# Altium project Volant5.PrjPcb
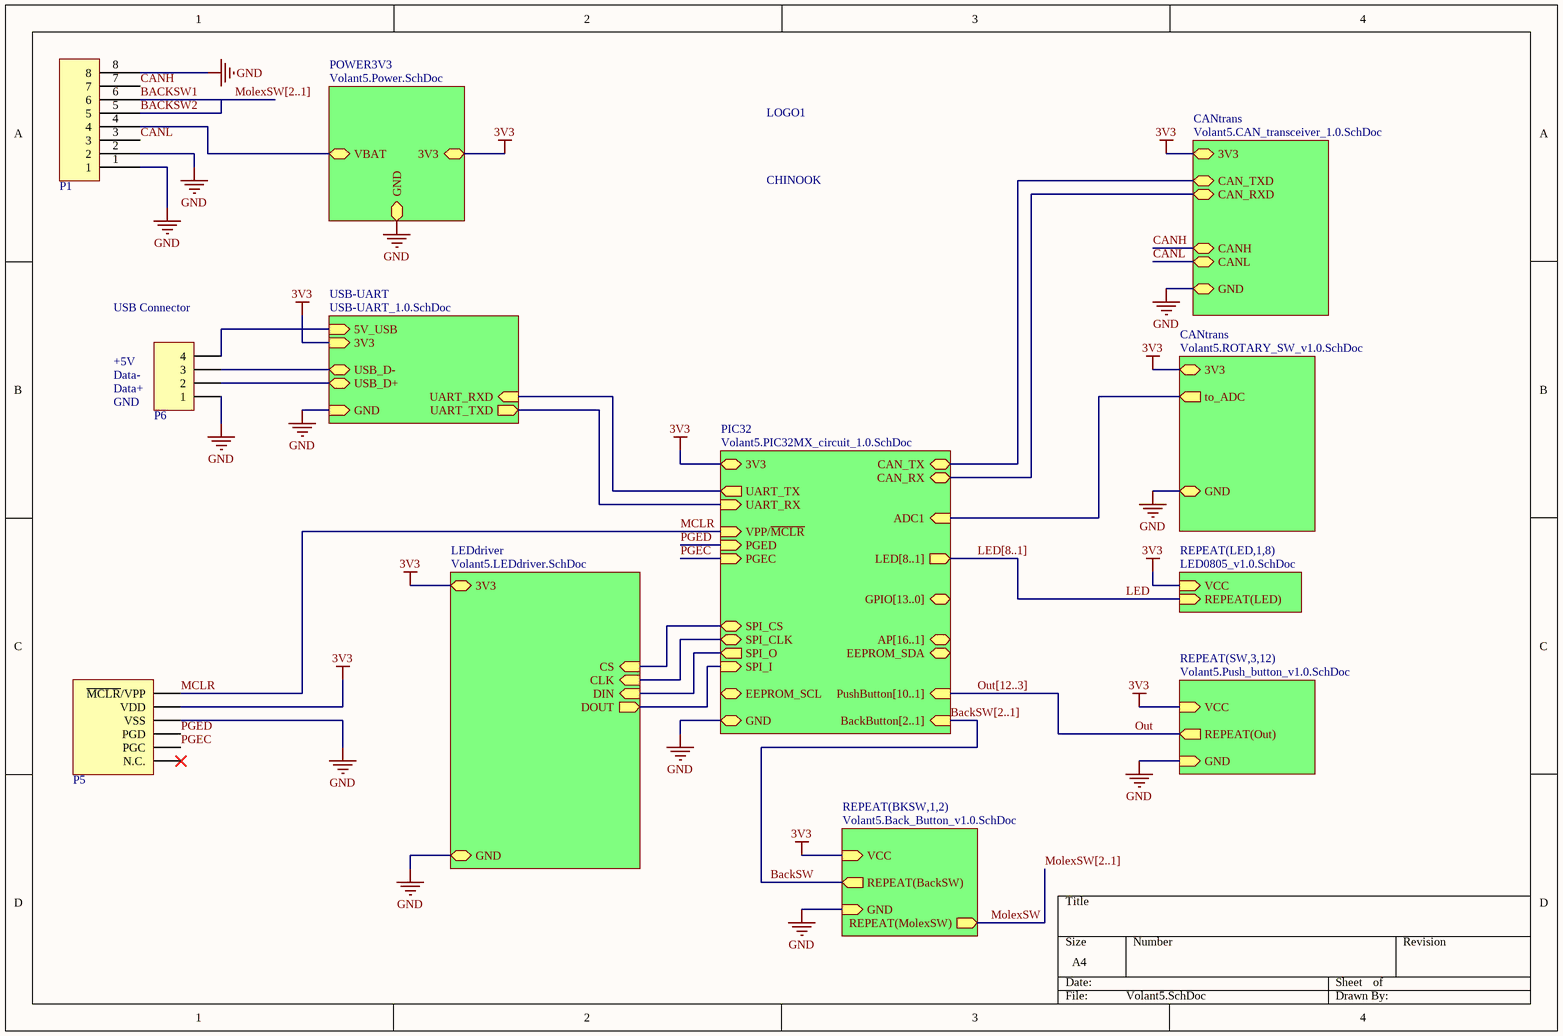
[diagram p0: Volant5.SchDoc]
10 sheets, 133 parts. Net scope: hierarchical (ports join the sheet entries above them; power ports are global).
Board file: Volant_v2.PcbDoc
Sheets:
  Volant5.SchDoc
    POWER3V3 = Volant5.Power.SchDoc
    PIC32 = Volant5.PIC32MX_circuit_1.0.SchDoc
    CANtrans = Volant5.CAN_transceiver_1.0.SchDoc
    SW3 = Volant5.Push_button_v1.0.SchDoc
    SW4 = Volant5.Push_button_v1.0.SchDoc
    SW5 = Volant5.Push_button_v1.0.SchDoc
    SW6 = Volant5.Push_button_v1.0.SchDoc
    SW7 = Volant5.Push_button_v1.0.SchDoc
    SW8 = Volant5.Push_button_v1.0.SchDoc
    SW9 = Volant5.Push_button_v1.0.SchDoc
    SW10 = Volant5.Push_button_v1.0.SchDoc
    SW11 = Volant5.Push_button_v1.0.SchDoc
    SW12 = Volant5.Push_button_v1.0.SchDoc
    LED1 = LED0805_v1.0.SchDoc
    LED2 = LED0805_v1.0.SchDoc
    LED3 = LED0805_v1.0.SchDoc
    LED4 = LED0805_v1.0.SchDoc
    LED5 = LED0805_v1.0.SchDoc
    LED6 = LED0805_v1.0.SchDoc
    LED7 = LED0805_v1.0.SchDoc
    LED8 = LED0805_v1.0.SchDoc
    LEDdriver = Volant5.LEDdriver.SchDoc
    USB-UART = USB-UART_1.0.SchDoc
    BKSW1 = Volant5.Back_Button_v1.0.SchDoc
    BKSW2 = Volant5.Back_Button_v1.0.SchDoc
    CANtrans = Volant5.ROTARY_SW_v1.0.SchDoc

## Sheet Volant5.SchDoc
size A4

### Parts
LOGO1  CHINOOK  [LOGO-CHINOOK]
P1  CON - MOLEX 8POS  [CON-MOLEX Mini Jr 8pin - RA]  (value not drawn)
P5  CON - HEADER PROG  [CON-PROG-PIC]  (value not drawn)
P6  CON - HEADER 1X4  [CON-HEADER-1X4]  (value not drawn)

### Sub-sheets
CANtrans = Volant5.CAN_transceiver_1.0.SchDoc: CAN_RXD (bidir), CAN_TXD (bidir), CANH (bidir), CANL (bidir), 3V3, GND
CANtrans = Volant5.ROTARY_SW_v1.0.SchDoc: to_ADC (out), GND, 3V3
LEDdriver = Volant5.LEDdriver.SchDoc: 3V3, GND, CLK (in), DIN (in), DOUT (out), CS (in)
PIC32 = Volant5.PIC32MX_circuit_1.0.SchDoc: 3V3, GND, CAN_RX (bidir), CAN_TX (bidir), UART_TX (out), UART_RX (in), AP[16..1] (bidir), GPIO[13..0] (bidir), EEPROM_SCL (bidir), EEPROM_SDA (bidir), PGED (in), PGEC (in), LED[8..1] (out), VPP/~{MCLR} (in), SPI_O (out), SPI_I (in), SPI_CLK, PushButton[10..1] (in), SPI_CS, BackButton[2..1] (in), ADC1 (in)
POWER3V3 = Volant5.Power.SchDoc: 3V3, GND, VBAT
REPEAT(BKSW,1,2) = Volant5.Back_Button_v1.0.SchDoc: REPEAT(BackSW) (out), VCC (in), GND (in), REPEAT(MolexSW) (out)
REPEAT(LED,1,8) = LED0805_v1.0.SchDoc: VCC (in), REPEAT(LED) (in)
REPEAT(SW,3,12) = Volant5.Push_button_v1.0.SchDoc: REPEAT(Out) (out), VCC (in), GND (in)
USB-UART = USB-UART_1.0.SchDoc: 3V3 (in), GND (in), UART_RXD (in), UART_TXD (out), 5V_USB (in), USB_D- (bidir), USB_D+ (bidir)

### Nets
3V3: P5.2(VDD) ; sheet POWER3V3/3V3, sheet PIC32/3V3, sheet CANtrans/3V3, sheet REPEAT(SW,3,12)/VCC, sheet REPEAT(LED,1,8)/VCC, sheet LEDdriver/3V3, sheet USB-UART/3V3, sheet REPEAT(BKSW,1,2)/VCC, sheet CANtrans/3V3
5V_USB: P6.4 ; sheet USB-UART/5V_USB
GND: P1.1 P1.2 P1.8 P5.3(VSS) P6.1 ; sheet POWER3V3/GND, sheet PIC32/GND, sheet CANtrans/GND, sheet REPEAT(SW,3,12)/GND, sheet LEDdriver/GND, sheet USB-UART/GND, sheet REPEAT(BKSW,1,2)/GND, sheet CANtrans/GND
VBAT: P1.4 ; sheet POWER3V3/VBAT
AP3: sheet PIC32/ADC1, sheet CANtrans/to_ADC
BackSW: sheet REPEAT(BKSW,1,2)/REPEAT(BackSW)
BACKSW1: P1.6  [also labelled MolexSW1]
BACKSW2: P1.5  [also labelled MolexSW2]
CAN_RX: sheet PIC32/CAN_RX, sheet CANtrans/CAN_RXD
CAN_TX: sheet PIC32/CAN_TX, sheet CANtrans/CAN_TXD
CANH: P1.7 ; sheet CANtrans/CANH
CANL: P1.3 ; sheet CANtrans/CANL
CLK: sheet PIC32/SPI_CLK, sheet LEDdriver/CLK
CS: sheet PIC32/SPI_CS, sheet LEDdriver/CS
DIN: sheet PIC32/SPI_O, sheet LEDdriver/DIN
DOUT: sheet PIC32/SPI_I, sheet LEDdriver/DOUT
LED: sheet REPEAT(LED,1,8)/REPEAT(LED)
MCLR: P5.1(~{MCLR}/VPP) ; sheet PIC32/VPP/~{MCLR}
MolexSW: sheet REPEAT(BKSW,1,2)/REPEAT(MolexSW)
Out: sheet REPEAT(SW,3,12)/REPEAT(Out)
PGEC: P5.5(PGC) ; sheet PIC32/PGEC
PGED: P5.4(PGD) ; sheet PIC32/PGED
UART_RXD: sheet PIC32/UART_TX, sheet USB-UART/UART_RXD
UART_TXD: sheet PIC32/UART_RX, sheet USB-UART/UART_TXD
USB_D+: P6.2 ; sheet USB-UART/USB_D+
USB_D-: P6.3 ; sheet USB-UART/USB_D-

Not connected (* = marked no-connect by the designer): P5 6(N.C.)*

### Buses and harness runs
bus BackSW[2..1] = sheet PIC32/BackButton[2..1]
bus LED[8..1] = sheet PIC32/LED[8..1]
bus MolexSW[2..1]
bus Out[12..3] = sheet PIC32/PushButton[10..1]

### Notes on the sheet
- (near P6) USB Connector
- +5V
- (near P6) Data-
- (near P6) Data+
- GND

### Library data of the parts
LOGO1 = LOGO - FOOTPRINT
P1 = CON - MOLEX 8POS: Mini-Fit Jr 8pin; (FLIED A): *; (FLIED B): *; (FLIED C): *; Manufacturer: MOLEX; Supplier 1: Digi-Key; Supplier Part Number 1: A30617-ND
P5 = CON - PROG HEADER 6: MICROCHIP CONNECTOR; (FLIED A): *; (FLIED B): *; (FLIED C): *; Manufacturer: *; Supplier 1: Digi-Key; Supplier Part Number 1: 609-3263-ND
P6 = CON - HEADER 1X4: 100mil header 1 row 4pins; Manufacturer: *; (FIELD A): *; (FIELD B): *; (FIELD C): *; Supplier 1: Digi-Key; Supplier Part Number 1: S1011EC-04-ND

## Sheet Volant5.Power.SchDoc
size A4
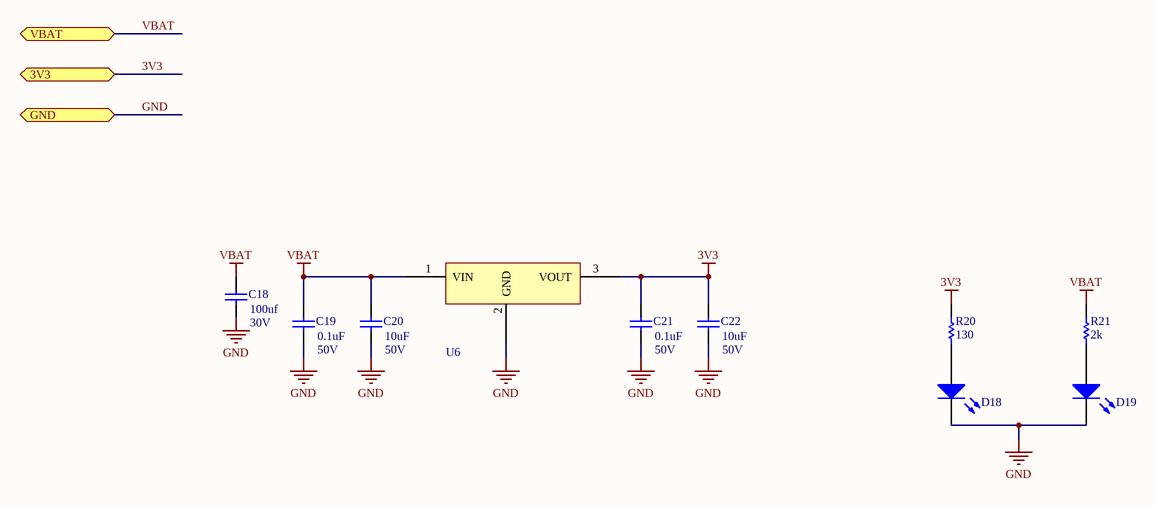
[diagram p1: Volant5.Power.SchDoc]

### Parts
C18  value 100uf  VOLTAGE: 30V  [CS-0603]  (hidden comment: CS - CAPACITOR)
C19  value 0.1uF  VOLTAGE: 50V  [CS-0603]  (hidden comment: CS - CAPACITOR)
C20  value 10uF  VOLTAGE: 50V  [CS-0603]  (hidden comment: CS - CAPACITOR)
C21  value 0.1uF  VOLTAGE: 50V  [CS-0603]  (hidden comment: CS - CAPACITOR)
C22  value 10uF  VOLTAGE: 50V  [CS-0603]  (hidden comment: CS - CAPACITOR)
D18  LED - NORMAL LED  [LED-0805 YELLOW]  (value not drawn)
D19  LED - NORMAL LED  [LED-0805 YELLOW]  (value not drawn)
R20  value 130  [RS-0603]  (hidden comment: RS - RESISTOR)
R21  value 2k  [RS-0603]  (hidden comment: RS - RESISTOR)
U6  OKI-78SR  [IC-OKI78SR-RA]  (value not drawn)

### Ports
3V3, GND, VBAT

### Nets
3V3: C21.2 C22.2 R20.2 U6.3(VOUT) ; port 3V3
GND: C18.1 C19.1 C20.1 C21.1 C22.1 D18.K D19.K U6.2(GND) ; port GND
VBAT: C18.2 C19.2 C20.2 R21.2 U6.1(VIN) ; port VBAT
NetD18_A: D18.A R20.1
NetD19_A: D19.A R21.1

### Library data of the parts
C18-C22 = CS - CAPACITOR: TOLERANCE: 10%; Supplier 1: *; (FIELD A): *; (FLIED C): *; (FIELD B): *; Manufacturer: *
  C18: Supplier Part Number 1: 493-1355-ND
  C19 C21: Supplier Part Number 1: 399-5089-1-ND
  C20 C22: Supplier Part Number 1: 587-3238-1-ND
R20 R21 = RS - RESISTOR: TOLERANCE: RES TOL; POWER: RES POWER; Supplier 1: *; (FIELD A): *; (FLIED C): *; (FIELD B): *; Manufacturer: *
  R20: Supplier Part Number 1: RHM150CFCT-ND
  R21: Supplier Part Number 1: ERJ-3EKF2001V
U6 = IC - OKI-78SR: Supplier 1: Digi-Key; Supplier Part Number 1: 811-2195-5-ND; (FIELD A): *; (FIELD B): *; (FIELD C): *; Manufacturer: *
D18 D19 = LED - NORMAL LED: FORWARS VOLTAGE: *; CURRENT: *; COLOR: *; Supplier Part Number 1: *; Supplier 1: *; (FIELD B): *; (FIELD A): *; (FIELD C): *; Manufacturer: *

## Sheet Volant5.PIC32MX_circuit_1.0.SchDoc
size A4
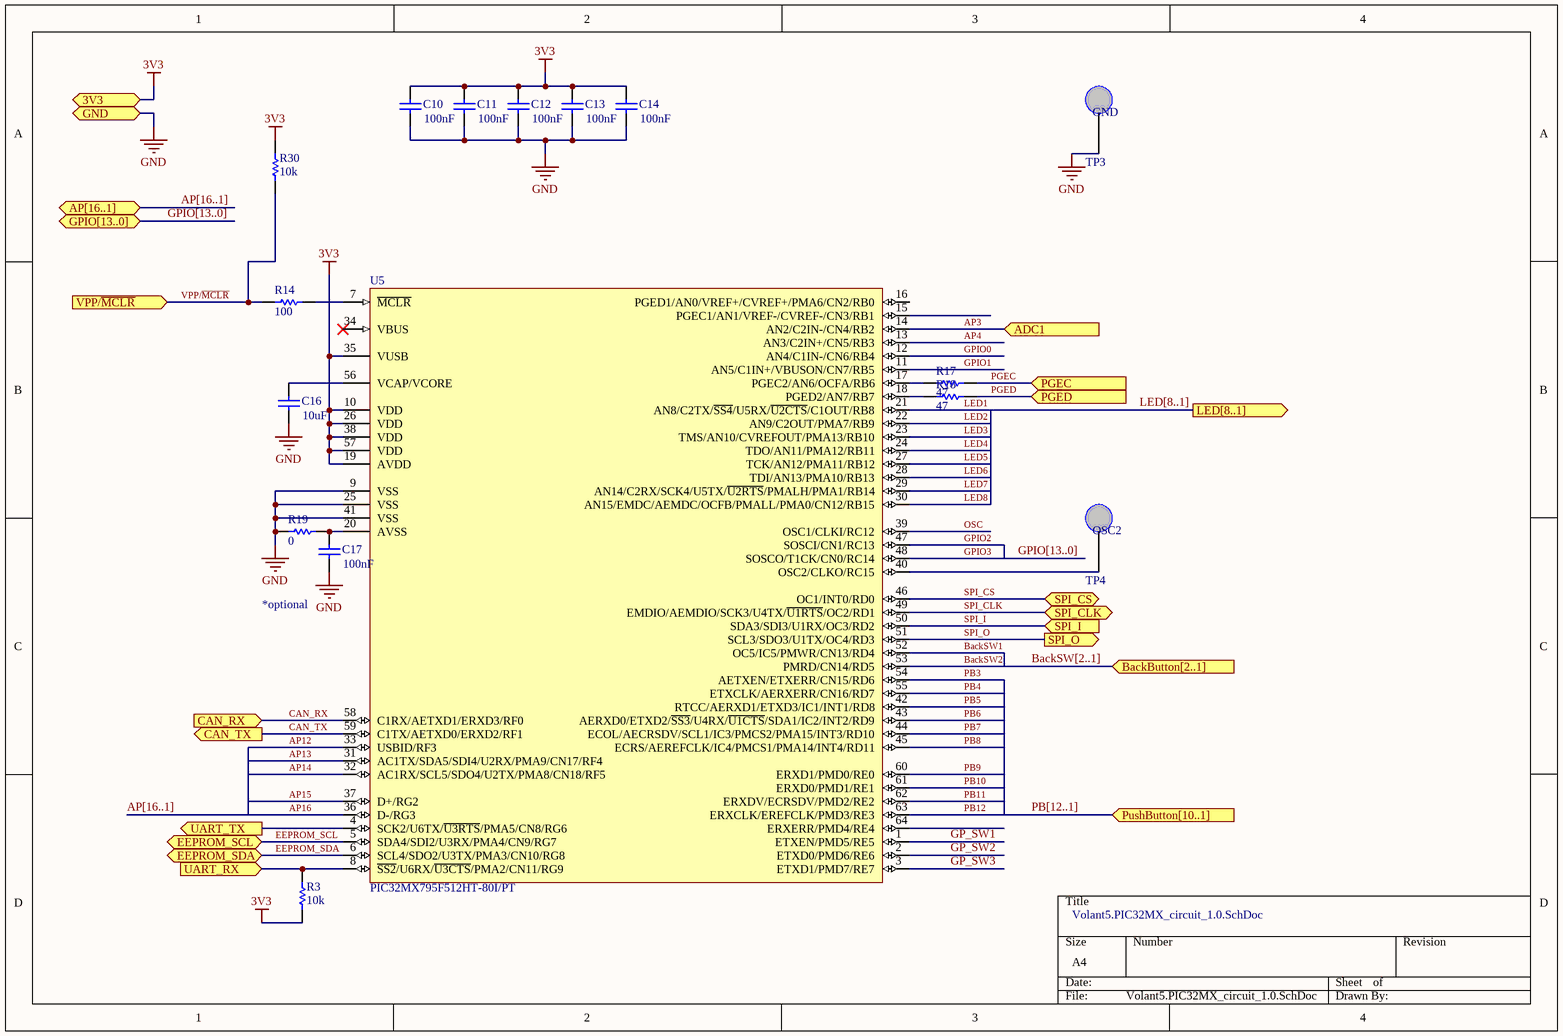
[diagram p2: Volant5.PIC32MX_circuit_1.0.SchDoc]

### Parts
C10  value 100nF  [CS-0603]  (hidden comment: CS - CAPACITOR)
C11  value 100nF  [CS-0603]  (hidden comment: CS - CAPACITOR)
C12  value 100nF  [CS-0603]  (hidden comment: CS - CAPACITOR)
C13  value 100nF  [CS-0603]  (hidden comment: CS - CAPACITOR)
C14  value 100nF  [CS-0603]  (hidden comment: CS - CAPACITOR)
C16  value 10uF  [CS-0603]  (hidden comment: CS - CAPACITOR)
C17  value 100nF  [CS-0603]  (hidden comment: CS - CAPACITOR)
R3  value 10k  [RS-0402]  (hidden comment: RS - RESISTOR)
R14  value 100  [RS-0603]  (hidden comment: RS - RESISTOR)
R17  value 47  [RS-0603]  (hidden comment: RS - RESISTOR)
R18  value 47  [RS-0603]  (hidden comment: RS - RESISTOR)
R19  value 0  [RS-0603]  (hidden comment: RS - RESISTOR)
R30  value 10k  [RS-0603]  (hidden comment: RS - RESISTOR)
TP3  GND  [TP - VERTICAL]
TP4  OSC2  [TP - VERTICAL]
U5  PIC32MX795F512HT-80I/PT  [IC-TQFP-64]

### Ports
3V3, ADC1 (in), AP[16..1] (bidir), BackButton[2..1] (in), CAN_RX (in), CAN_TX (out), EEPROM_SCL (bidir), EEPROM_SDA (bidir), GND, GPIO[13..0] (bidir), LED[8..1] (out), PGEC (in), PGED (in), PushButton[10..1] (in), SPI_CLK, SPI_CS, SPI_I (in), SPI_O (out), UART_RX (in), UART_TX (out), VPP/~{MCLR} (in)

### Nets
3V3: C10.2 C11.2 C12.2 C13.2 C14.2 R3.1 R30.2 U5.10(VDD) U5.19(AVDD) U5.26(VDD) U5.35(VUSB) U5.38(VDD) U5.57(VDD) ; port 3V3
GND: C10.1 C11.1 C12.1 C13.1 C14.1 C16.1 C17.1 R19.2 TP3.1 U5.9(VSS) U5.25(VSS) U5.41(VSS) ; port GND
AP3: U5.14(AN2/C2IN-/CN4/RB2) ; port ADC1
AP4: U5.13(AN3/C2IN+/CN5/RB3)
AP12: U5.33(USBID/RF3)
AP13: U5.31(AC1TX/SDA5/SDI4/U2RX/PMA9/CN17/RF4)
AP14: U5.32(AC1RX/SCL5/SDO4/U2TX/PMA8/CN18/RF5)
AP15: U5.37(D+/RG2)
AP16: U5.36(D-/RG3)
BACKSW1: U5.52(OC5/IC5/PMWR/CN13/RD4)
BACKSW2: U5.53(PMRD/CN14/RD5)
CAN_RX: U5.58(C1RX/AETXD1/ERXD3/RF0) ; port CAN_RX
CAN_TX: U5.59(C1TX/AETXD0/ERXD2/RF1) ; port CAN_TX
EEPROM_SCL: U5.5(SDA4/SDI2/U3RX/PMA4/CN9/RG7) ; port EEPROM_SCL
EEPROM_SDA: U5.6(SCL4/SDO2/U3TX/PMA3/CN10/RG8) ; port EEPROM_SDA
GP_SW1: U5.1(ETXEN/PMD5/RE5)
GP_SW2: U5.2(ETXD0/PMD6/RE6)
GP_SW3: U5.3(ETXD1/PMD7/RE7)
GPIO0: U5.12(AN4/C1IN-/CN6/RB4)
GPIO1: U5.11(AN5/C1IN+/VBUSON/CN7/RB5)
GPIO2: U5.47(SOSCI/CN1/RC13)
GPIO3: U5.48(SOSCO/T1CK/CN0/RC14)
LED1: U5.21(AN8/C2TX/~{SS4}/U5RX/~{U2CTS}/C1OUT/RB8)
LED2: U5.22(AN9/C2OUT/PMA7/RB9)
LED3: U5.23(TMS/AN10/CVREFOUT/PMA13/RB10)
LED4: U5.24(TDO/AN11/PMA12/RB11)
LED5: U5.27(TCK/AN12/PMA11/RB12)
LED6: U5.28(TDI/AN13/PMA10/RB13)
LED7: U5.29(AN14/C2RX/SCK4/U5TX/~{U2RTS}/PMALH/PMA1/RB14)
LED8: U5.30(AN15/EMDC/AEMDC/OCFB/PMALL/PMA0/CN12/RB15)
OSC: U5.39(OSC1/CLKI/RC12)
PB3: U5.54(AETXEN/ETXERR/CN15/RD6)  [project net Out3]
PB4: U5.55(ETXCLK/AERXERR/CN16/RD7)  [project net Out4]
PB5: U5.42(RTCC/AERXD1/ETXD3/IC1/INT1/RD8)  [project net Out5]
PB6: U5.43(AERXD0/ETXD2/~{SS3}/U4RX/~{U1CTS}/SDA1/IC2/INT2/RD9)  [project net Out6]
PB7: U5.44(ECOL/AECRSDV/SCL1/IC3/PMCS2/PMA15/INT3/RD10)  [project net Out7]
PB8: U5.45(ECRS/AEREFCLK/IC4/PMCS1/PMA14/INT4/RD11)  [project net Out8]
PB9: U5.60(ERXD1/PMD0/RE0)  [project net Out9]
PB10: U5.61(ERXD0/PMD1/RE1)  [project net Out10]
PB11: U5.62(ERXDV/ECRSDV/PMD2/RE2)  [project net Out11]
PB12: U5.63(ERXCLK/EREFCLK/PMD3/RE3)  [project net Out12]
PGEC: R17.1 ; port PGEC
PGED: R18.1 ; port PGED
SPI_CLK: U5.49(EMDIO/AEMDIO/SCK3/U4TX/~{U1RTS}/OC2/RD1) ; port SPI_CLK  [project net CLK]
SPI_CS: U5.46(OC1/INT0/RD0) ; port SPI_CS  [project net CS]
SPI_I: U5.50(SDA3/SDI3/U1RX/OC3/RD2) ; port SPI_I  [project net DOUT]
SPI_O: U5.51(SCL3/SDO3/U1TX/OC4/RD3) ; port SPI_O  [project net DIN]
UART_RXD: U5.4(SCK2/U6TX/~{U3RTS}/PMA5/CN8/RG6) ; port UART_TX
UART_TXD: R3.2 U5.8(~{SS2}/U6RX/~{U3CTS}/PMA2/CN11/RG9) ; port UART_RX
VPP/~{MCLR}: R14.2 R30.1 ; port VPP/~{MCLR}  [project net MCLR]
NetC16_2: C16.2 U5.56(VCAP/VCORE)
NetC17_2: C17.2 R19.1 U5.20(AVSS)
NetR14_1: R14.1 U5.7(~{MCLR})
NetR17_2: R17.2 U5.17(PGEC2/AN6/OCFA/RB6)
NetR18_2: R18.2 U5.18(PGED2/AN7/RB7)
NetTP4_1: TP4.1 U5.40(OSC2/CLKO/RC15)

Not connected (* = marked no-connect by the designer): U5 15(PGEC1/AN1/VREF-/CVREF-/CN3/RB1) 16(PGED1/AN0/VREF+/CVREF+/PMA6/CN2/RB0) 34(VBUS)* 64(ERXERR/PMD4/RE4)

### Buses and harness runs
bus AP[16..1]
bus AP[16..1] = port AP[16..1]
bus BackSW[2..1] = port BackButton[2..1]
bus GPIO[13..0]
bus GPIO[13..0] = port GPIO[13..0]
bus LED[8..1] = port LED[8..1]
bus PB[12..1] = port PushButton[10..1]

### Notes on the sheet
- *optional

### Library data of the parts
C10-C14 C16 C17 = CS - CAPACITOR: TOLERANCE: 10%; Supplier 1: *; (FIELD A): *; (FLIED C): *; (FIELD B): *; Manufacturer: *
  C10-C14 C17: Supplier Part Number 1: 490-1532-1-ND
  C16: Supplier Part Number 1: 587-3238-1-ND
R3 R14 R17-R19 R30 = RS - RESISTOR: TOLERANCE: RES TOL; POWER: RES POWER; Supplier 1: *; (FIELD A): *; (FLIED C): *; (FIELD B): *; Manufacturer: *
  R3 R30: Supplier Part Number 1: *
  R14: Supplier Part Number 1: P100GCT-ND
  R17 R18: Supplier Part Number 1: 1276-4539-1-ND
  R19: Supplier Part Number 1: P0.0GCT-ND
TP3 TP4 = TP - Test point vertical: (FIELD A): *; (FIELD B): *; (FIELD C): *; Manufacturer: *; Supplier 1: Newark; Supplier Part Number 1: 62W5140
U5 = IC - PIC32MX795F512HT-80I/PT: Manufacturer: Microchip; (FLIED A): *; (FLIED B): *; (FLIED C): *; Supplier 1: Digi-Key; Supplier Part Number 1: PIC32MX795F512H-80I/PT-ND

## Sheet Volant5.CAN_transceiver_1.0.SchDoc
size A
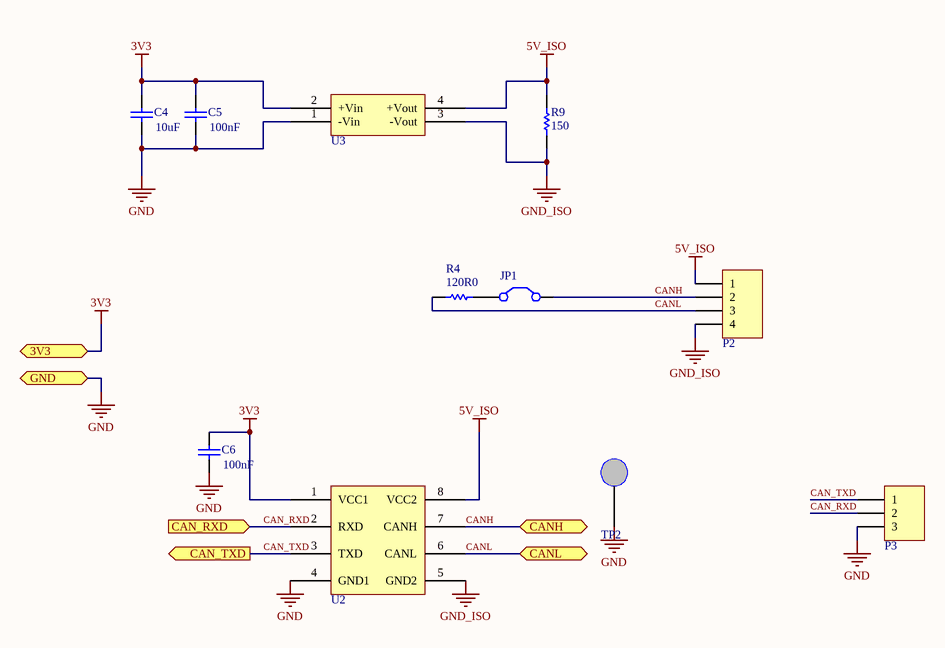
[diagram p3: Volant5.CAN_transceiver_1.0.SchDoc]

### Parts
C4  value 10uF  [CS-0603]  (hidden comment: CS - CAPACITOR)
C5  value 100nF  [CS-0603]  (hidden comment: CS - CAPACITOR)
C6  value 100nF  [CS-0603]  (hidden comment: CS - CAPACITOR)
JP1  JMP - Jumper  [HEADER-2-JMP]  (value not drawn)
P2  CON - HEADER 1X4  [CON-HEADER-1X4]  (value not drawn)
P3  CON - HEADER 1X3  [CON-HEADER-1X3]  (value not drawn)
R4  value 120R0  [RS-0603]  (hidden comment: RS - RESISTOR)
R9  value 150  [RS-0603]  (hidden comment: RS - RESISTOR)
TP2  5003K  [TP - VERTICAL]  (value not drawn)
U2  IC - ISO1050  [IC-SOP-8]  (value not drawn)
U3  IC - CME0305S3C  [IC-SIP-4]  (value not drawn)

### Ports
3V3, CAN_RXD (in), CAN_TXD (out), CANH (bidir), CANL (bidir), GND

### Nets
3V3: C4.2 C5.2 C6.2 U2.1(VCC1) U3.2(+Vin) ; port 3V3
5V_ISO: P2.1 R9.2 U2.8(VCC2) U3.4(+Vout)
GND: C4.1 C5.1 C6.1 P3.3 TP2.1 U2.4(GND1) U3.1(-Vin) ; port GND
GND_ISO: P2.4 R9.1 U2.5(GND2) U3.3(-Vout)
CAN_RXD: P3.2 U2.2(RXD) ; port CAN_RXD  [project net CAN_RX]
CAN_TXD: P3.1 U2.3(TXD) ; port CAN_TXD  [project net CAN_TX]
CANH: JP1.2(C2) P2.2 U2.7(CANH) ; port CANH
CANL: P2.3 R4.2 U2.6(CANL) ; port CANL
NetJP1_1: JP1.1(C1) R4.1

### Library data of the parts
C4-C6 = CS - CAPACITOR: TOLERANCE: 10%; Supplier 1: *; (FIELD A): *; (FLIED C): *; (FIELD B): *; Manufacturer: *
  C4: Supplier Part Number 1: 587-3238-1-ND
  C5 C6: Supplier Part Number 1: 490-1532-1-ND
JP1 = JMP - Jumper: Jumper; Supplier Part Number 1: *; Supplier 1: *; Manufacturer: *; (FIELD A): *; (FIELD B): *; (FIELD C): *
P2 = CON - HEADER 1X4: 100mil header 1 row 4pins; Manufacturer: *; (FIELD A): *; (FIELD B): *; (FIELD C): *; Supplier 1: Digi-Key; Supplier Part Number 1: S1011EC-04-ND
P3 = CON - HEADER 1X3: 100mil header 1 row 3pins; Manufacturer: *; (FIELD A): *; (FIELD B): *; (FIELD C): *; Supplier 1: Digi-Key; Supplier Part Number 1: S1212EC-03-ND
R4 R9 = RS - RESISTOR: TOLERANCE: RES TOL; POWER: RES POWER; Supplier 1: *; (FIELD A): *; (FLIED C): *; (FIELD B): *; Manufacturer: *
  R4: Supplier Part Number 1: *
  R9: Supplier Part Number 1: RHM150CFCT-ND
TP2 = TP - Test point vertical: (FIELD A): *; (FIELD B): *; (FIELD C): *; Manufacturer: *; Supplier 1: Newark; Supplier Part Number 1: 62W5140
U2 = IC - ISO1050: Isolated CAN transceiver; Manufacturer: Texas Instrument; (FIELD A): *; (FIELD B): *; (FIELD C): *; Supplier 1: Digi-Key; Supplier Part Number 1: 296-24818-1-ND
U3 = IC - CME0305S3C: Supplier 1: Digi-Key; Supplier Part Number 1: 811-2890-5-ND; Manufacturer: *; (FIELD A): *; (FIELD B): *; (FIELD C): *

## Sheet Volant5.Push_button_v1.0.SchDoc
size A
Used 10 times, as channels SW3, SW4, SW5, SW6, SW7, SW8, SW9, SW10, SW11, SW12. Parts and nets are listed once, with the designators drawn on the sheet.
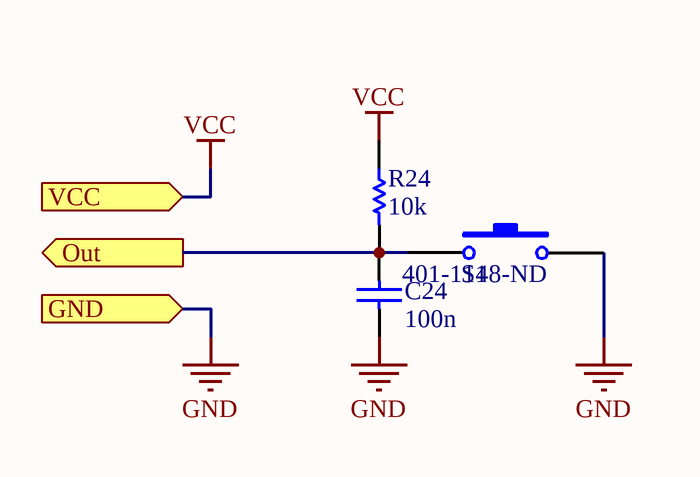
[diagram p4: Volant5.Push_button_v1.0.SchDoc]

### Parts
C24  value 100n  [CS-0603]  (hidden comment: CS - CAPACITOR)
R24  value 10k  [RS-0603]  (hidden comment: RS - RESISTOR)
S1  Cap black: 401-1148-ND  [SW-ESE20C443]  (hidden comment: SW - Tactile Switch)

### Ports
GND (in), Out (out), VCC (in)

### Nets
GND: C24.1 S1.2 ; port GND
VCC: R24.1 ; port VCC
Out: C24.2 R24.2 S1.1 ; port Out

### Channels
SW3: designators end in .1; ports GND=GND Out=Out3 VCC=3V3
SW4: designators end in .2; ports GND=GND Out=Out4 VCC=3V3
SW5: designators end in .3; ports GND=GND Out=Out5 VCC=3V3
SW6: designators end in .4; ports GND=GND Out=Out6 VCC=3V3
SW7: designators end in .5; ports GND=GND Out=Out7 VCC=3V3
SW8: designators end in .6; ports GND=GND Out=Out8 VCC=3V3
SW9: designators end in .7; ports GND=GND Out=Out9 VCC=3V3
SW10: designators end in .8; ports GND=GND Out=Out10 VCC=3V3
SW11: designators end in .9; ports GND=GND Out=Out11 VCC=3V3
SW12: designators end in .10; ports GND=GND Out=Out12 VCC=3V3

### Library data of the parts
C24 = CS - CAPACITOR: VOLTAGE: 16V; TOLERANCE: 10%; Supplier 1: *; Supplier Part Number 1: 490-1532-1-ND; (FIELD A): *; (FLIED C): *; (FIELD B): *; Manufacturer: *
R24 = RS - RESISTOR: POWER: RES POWER; TOLERANCE: RES TOL; Supplier Part Number 1: RHM10.0KCFCT-ND; Supplier 1: *; (FIELD A): *; (FLIED C): *; (FIELD B): *; Manufacturer: *
S1 = SW - Tactile Switch: Supplier 1: Digi-Key; Supplier Part Number 1: 450-1658-ND; (FLIED B): *; (FLIED C): *; Manufacturer: *; Supplier 2: Digi-Key; Supplier Part Number 2: 450-1758-2-ND; Supplier Part Number 3: P12347S-ND

## Sheet LED0805_v1.0.SchDoc
size A
Used 8 times, as channels LED1, LED2, LED3, LED4, LED5, LED6, LED7, LED8. Parts and nets are listed once, with the designators drawn on the sheet.
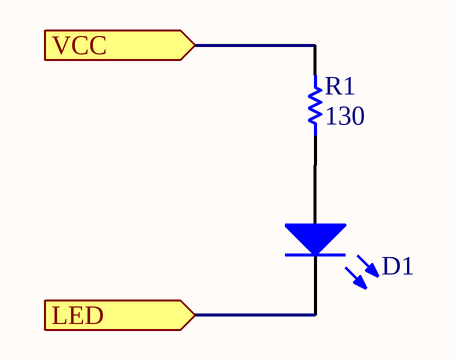
[diagram p5: LED0805_v1.0.SchDoc]

### Parts
D1  LED - NORMAL LED  [LED-0805 BLUE]  (value not drawn)
R1  value 130  [RS-0603]  (hidden comment: RS - RESISTOR)

### Ports
LED (in), VCC (in)

### Nets
LED: D1.K ; port LED
VCC: R1.2 ; port VCC
NetD1_A: D1.A R1.1

### Channels
LED1: designators end in .1; ports LED=LED1 VCC=3V3
LED2: designators end in .2; ports LED=LED2 VCC=3V3
LED3: designators end in .3; ports LED=LED3 VCC=3V3
LED4: designators end in .4; ports LED=LED4 VCC=3V3
LED5: designators end in .5; ports LED=LED5 VCC=3V3
LED6: designators end in .6; ports LED=LED6 VCC=3V3
LED7: designators end in .7; ports LED=LED7 VCC=3V3
LED8: designators end in .8; ports LED=LED8 VCC=3V3

### Library data of the parts
R1 = RS - RESISTOR: TOLERANCE: RES TOL; POWER: RES POWER; Supplier Part Number 1: RHM150CFCT-ND; Supplier 1: *; (FIELD A): *; (FLIED C): *; (FIELD B): *; Manufacturer: *
D1 = LED - NORMAL LED: FORWARS VOLTAGE: *; CURRENT: *; COLOR: *; Supplier Part Number 1: VAOL-S6SB4CT-ND; Supplier 1: *; (FIELD B): *; (FIELD A): *; (FIELD C): *; Manufacturer: *

## Sheet Volant5.LEDdriver.SchDoc
size A4
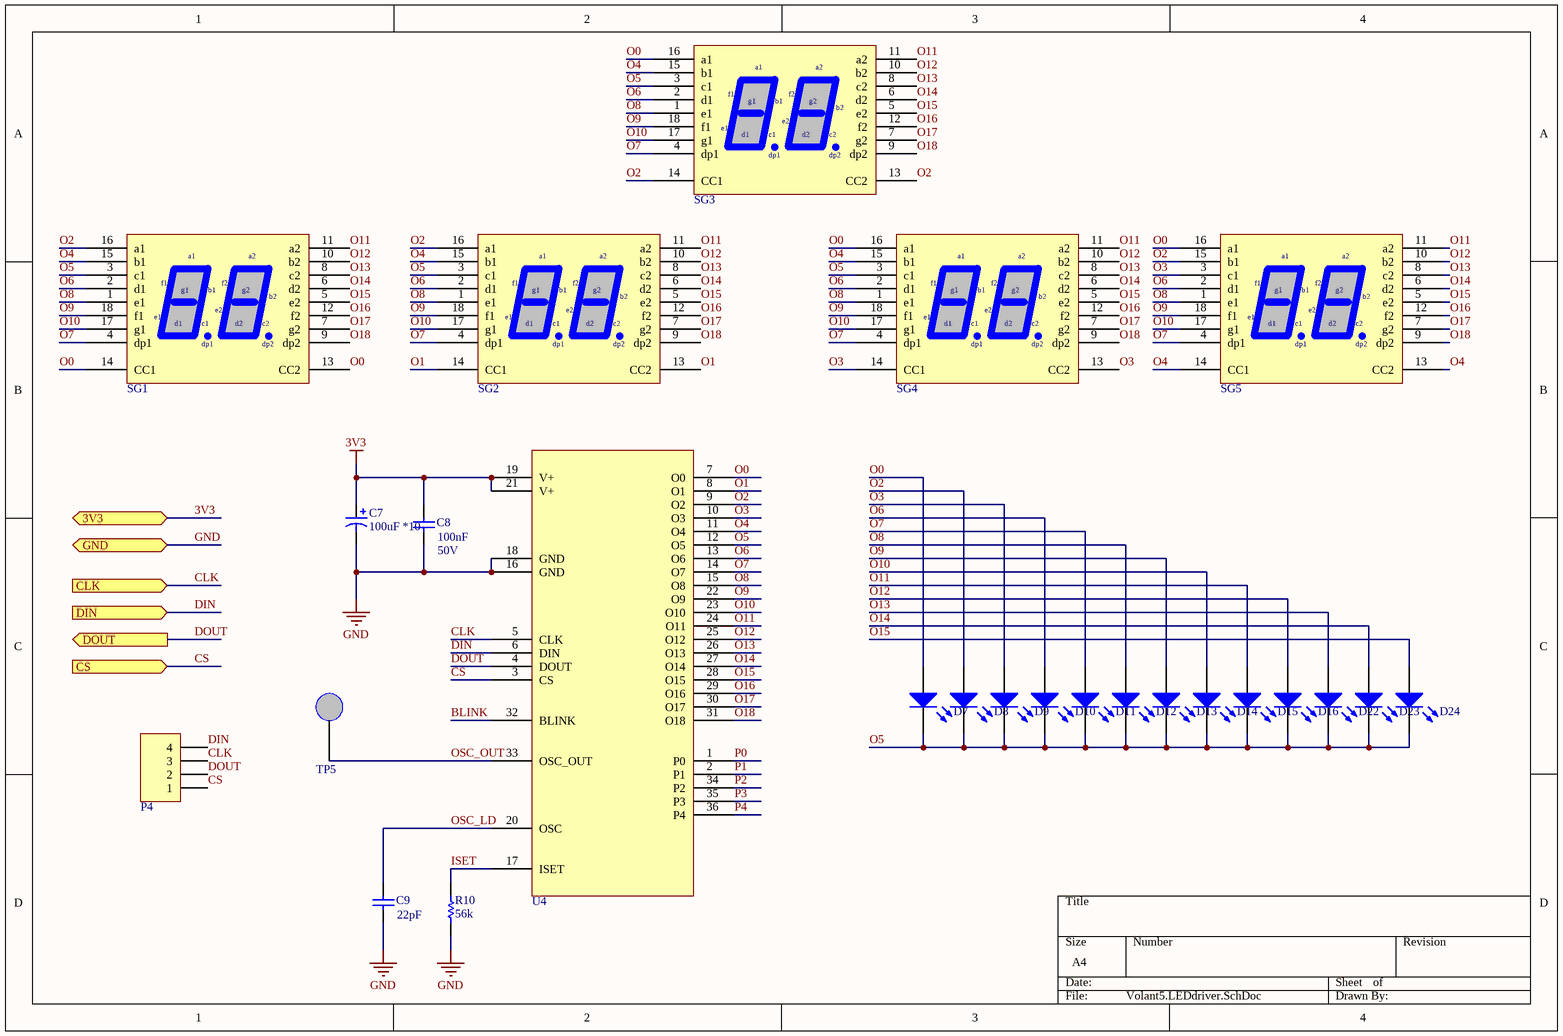
[diagram p6: Volant5.LEDdriver.SchDoc]

### Parts
C7  value 100uF *10  [CS-POL-6.3X4.2]  (hidden comment: CS - CAPACITOR ELECTROLYTIC)
C8  value 100nF  VOLTAGE: 50V  [CS-0603]  (hidden comment: CS - CAPACITOR)
C9  value 22pF  [CS-0603]  (hidden comment: CS - CAPACITOR)
D7  LED - NORMAL LED  [LED-1206 BLUE]  (value not drawn)
D8  LED - NORMAL LED  [LED-1206 BLUE]  (value not drawn)
D9  LED - NORMAL LED  [LED-1206 BLUE]  (value not drawn)
D10  LED - NORMAL LED  [LED-1206 BLUE]  (value not drawn)
D11  LED - NORMAL LED  [LED-1206 BLUE]  (value not drawn)
D12  LED - NORMAL LED  [LED-1206 BLUE]  (value not drawn)
D13  LED - NORMAL LED  [LED-1206 BLUE]  (value not drawn)
D14  LED - NORMAL LED  [LED-1206 BLUE]  (value not drawn)
D15  LED - NORMAL LED  [LED-1206 BLUE]  (value not drawn)
D16  LED - NORMAL LED  [LED-1206 BLUE]  (value not drawn)
D22  LED - NORMAL LED  [LED-1206 BLUE]  (value not drawn)
D23  LED - NORMAL LED  [LED-1206 BLUE]  (value not drawn)
D24  LED - NORMAL LED  [LED-1206 BLUE]  (value not drawn)
P4  CON - HEADER 1X4  [CON-HEADER-1X4]  (value not drawn)
R10  value 56k  [RS-0603]  (hidden comment: RS - RESISTOR)
SG1  LB-602VK2  [DISP-DUAL 7SEG 18 pin]  (value not drawn)
SG2  LB-602VK2  [DISP-DUAL 7SEG 18 pin]  (value not drawn)
SG3  LB-602VK2  [DISP-DUAL 7SEG 18 pin]  (value not drawn)
SG4  LB-602VK2  [DISP-DUAL 7SEG 18 pin]  (value not drawn)
SG5  LB-602VK2  [DISP-DUAL 7SEG 18 pin]  (value not drawn)
TP5  OSC LED  [TP - VERTICAL]  (value not drawn)
U4  MAX6954AAX  [IC-SSOP-36]  (value not drawn)

### Ports
3V3, CLK (in), CS (in), DIN (in), DOUT (out), GND

### Nets
3V3: C7.1 C8.2 U4.19(V+) U4.21(V+) ; port 3V3
GND: C7.2 C8.1 C9.1 R10.1 U4.16(GND) U4.18(GND) ; port GND
BLINK: U4.32(BLINK)
CLK: P4.3 U4.5(CLK) ; port CLK
CS: P4.1 U4.3(CS) ; port CS
DIN: P4.4 U4.6(DIN) ; port DIN
DOUT: P4.2 U4.4(DOUT) ; port DOUT
ISET: R10.2 U4.17(ISET)
O0: D7.A SG1.13(CC2) SG1.14(CC1) SG3.16(a1) SG4.16(a1) SG5.16(a1) U4.7(O0)
O1: SG2.13(CC2) SG2.14(CC1) U4.8(O1)
O2: D8.A SG1.16(a1) SG2.16(a1) SG3.13(CC2) SG3.14(CC1) SG5.15(b1) U4.9(O2)
O3: D9.A SG4.13(CC2) SG4.14(CC1) SG5.3(c1) U4.10(O3)
O4: SG1.15(b1) SG2.15(b1) SG3.15(b1) SG4.15(b1) SG5.13(CC2) SG5.14(CC1) U4.11(O4)
O5: D7.K D8.K D9.K D10.K D11.K D12.K D13.K D14.K D15.K D16.K D22.K D23.K D24.K SG1.3(c1) SG2.3(c1) SG3.3(c1) SG4.3(c1) U4.12(O5)
O6: D10.A SG1.2(d1) SG2.2(d1) SG3.2(d1) SG4.2(d1) SG5.2(d1) U4.13(O6)
O7: D11.A SG1.4(dp1) SG2.4(dp1) SG3.4(dp1) SG4.4(dp1) SG5.4(dp1) U4.14(O7)
O8: D12.A SG1.1(e1) SG2.1(e1) SG3.1(e1) SG4.1(e1) SG5.1(e1) U4.15(O8)
O9: D13.A SG1.18(f1) SG2.18(f1) SG3.18(f1) SG4.18(f1) SG5.18(f1) U4.22(O9)
O10: D14.A SG1.17(g1) SG2.17(g1) SG3.17(g1) SG4.17(g1) SG5.17(g1) U4.23(O10)
O11: D15.A SG1.11(a2) SG2.11(a2) SG3.11(a2) SG4.11(a2) SG5.11(a2) U4.24(O11)
O12: D16.A SG1.10(b2) SG2.10(b2) SG3.10(b2) SG4.10(b2) SG5.10(b2) U4.25(O12)
O13: D22.A SG1.8(c2) SG2.8(c2) SG3.8(c2) SG4.8(c2) SG5.8(c2) U4.26(O13)
O14: D23.A SG1.6(d2) SG2.6(d2) SG3.6(d2) SG4.6(d2) SG5.6(d2) U4.27(O14)
O15: D24.A SG1.5(e2) SG2.5(e2) SG3.5(e2) SG4.5(e2) SG5.5(e2) U4.28(O15)
O16: SG1.12(f2) SG2.12(f2) SG3.12(f2) SG4.12(f2) SG5.12(f2) U4.29(O16)
O17: SG1.7(g2) SG2.7(g2) SG3.7(g2) SG4.7(g2) SG5.7(g2) U4.30(O17)
O18: SG1.9(dp2) SG2.9(dp2) SG3.9(dp2) SG4.9(dp2) SG5.9(dp2) U4.31(O18)
OSC_LD: C9.2 U4.20(OSC)
OSC_OUT: TP5.1 U4.33(OSC_OUT)
P0: U4.1(P0)
P1: U4.2(P1)
P2: U4.34(P2)
P3: U4.35(P3)
P4: U4.36(P4)

### Library data of the parts
C7 = CS - CAPACITOR ELECTROLYTIC: TOLERANCE: 10%; Supplier 1: *; Supplier Part Number 1: 493-2096-1-ND; (FIELD A): *; (FLIED C): *; (FIELD B): *; Manufacturer: *; VOLTAGE: VOLTAGE
C8 C9 = CS - CAPACITOR: TOLERANCE: 10%; Supplier 1: *; (FIELD A): *; (FLIED C): *; (FIELD B): *; Manufacturer: *
  C8: Supplier Part Number 1: 490-1532-1-ND
  C9: Supplier Part Number 1: 399-9031-1-ND
D7-D16 D22-D24 = LED - NORMAL LED: FORWARS VOLTAGE: 1,75V; CURRENT: 20mA; COLOR: RED; Supplier Part Number 1: 511-1286-2-ND; Supplier 1: Digi-Key; (FIELD B): *; (FIELD A): *; (FIELD C): *; Manufacturer: *
P4 = CON - HEADER 1X4: 100mil header 1 row 4pins; Manufacturer: *; (FIELD A): *; (FIELD B): *; (FIELD C): *; Supplier 1: Digi-Key; Supplier Part Number 1: S1011EC-04-ND
R10 = RS - RESISTOR: TOLERANCE: RES TOL; POWER: RES POWER; Supplier Part Number 1: *; Supplier 1: *; (FIELD A): *; (FLIED C): *; (FIELD B): *; Manufacturer: *
SG1-SG5 = DISP - LB-602VK2: DUAL 7 SEG DISP HIGH BRIGHTNESS; Manufacturer: ROHM; (FIELD A): RED; (FIELD B): 14.3 mm high; (FIELD C): Cathode Commune; Supplier 1: Digi-Key; Supplier Part Number 1: 511-1562-ND
TP5 = TP - Test point vertical: (FIELD A): *; (FIELD B): *; (FIELD C): *; Manufacturer: *; Supplier 1: Newark; Supplier Part Number 1: 62W5140
U4 = IC - MAX6954: DRIVE 8 DIGIT 7SEG; Manufacturer: Maxim Integrated; Supplier 1: Digi-Key; Supplier Part Number 1: MAX6954AAX+-ND; (FIELD A): *; (FIELD B): *; (FIELD C): *

## Sheet USB-UART_1.0.SchDoc
size A
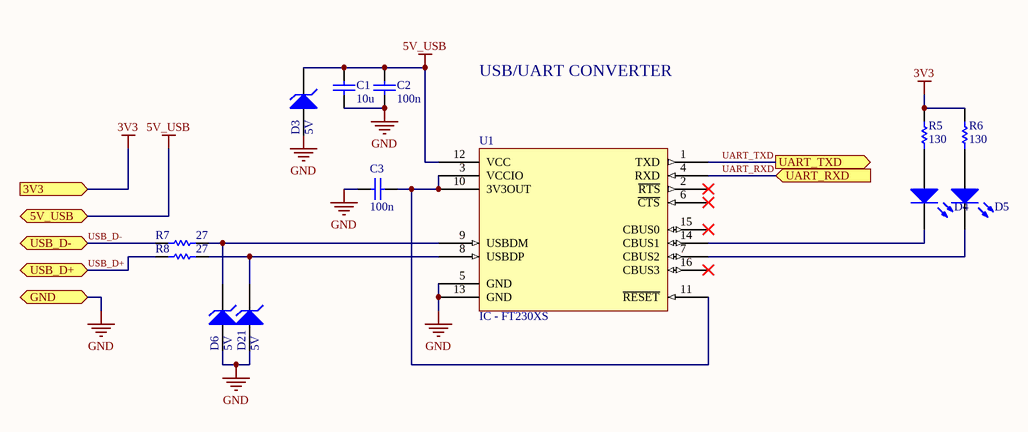
[diagram p7: USB-UART_1.0.SchDoc]

### Parts
C1  value 10u  [CS-0603]  (hidden comment: CS - CAPACITOR)
C2  value 100n  [CS-0603]  (hidden comment: CS - CAPACITOR)
C3  value 100n  [CS-0603]  (hidden comment: CS - CAPACITOR)
D3  Voltage - Reverse Standoff (Typ): 5V  [DS-SOD523]  (hidden comment: DS - TVS ESD5Z5.0T1G)
D4  LED - NORMAL LED  [LED-0603 BLUE]  (value not drawn)
D5  LED - NORMAL LED  [LED-0603 BLUE]  (value not drawn)
D6  Voltage - Reverse Standoff (Typ): 5V  [DS-SOD523]  (hidden comment: DS - TVS ESD5Z5.0T1G)
D21  Voltage - Reverse Standoff (Typ): 5V  [DS-SOD523]  (hidden comment: DS - TVS ESD5Z5.0T1G)
R5  value 130  [RS-0603]  (hidden comment: RS - RESISTOR)
R6  value 130  [RS-0603]  (hidden comment: RS - RESISTOR)
R7  value 27  [RS-0603]  (hidden comment: RS - RESISTOR)
R8  value 27  [RS-0603]  (hidden comment: RS - RESISTOR)
U1  IC - FT230XS  [IC-SSOP-16]

### Ports
3V3 (in), 5V_USB, GND, UART_RXD (in), UART_TXD (out), USB_D+ (bidir), USB_D- (bidir)

### Nets
3V3: R5.2 R6.2 ; port 3V3
5V_USB: C1.2 C2.2 D3.K U1.12(VCC) ; port 5V_USB
GND: C1.1 C2.1 C3.2 D3.A D6.A D21.A U1.5(GND) U1.13(GND) ; port GND
UART_RXD: U1.4(RXD) ; port UART_RXD
UART_TXD: U1.1(TXD) ; port UART_TXD
USB_D+: R8.2 ; port USB_D+
USB_D-: R7.2 ; port USB_D-
NetC3_1: C3.1 U1.3(VCCIO) U1.10(3V3OUT) U1.11(~{RESET})
NetD4_A: D4.A R5.1
NetD4_K: D4.K U1.14(CBUS1)
NetD5_A: D5.A R6.1
NetD5_K: D5.K U1.7(CBUS2)
NetD6_K: D6.K R7.1 U1.9(USBDM)
NetD21_K: D21.K R8.1 U1.8(USBDP)

Not connected (* = marked no-connect by the designer): U1 2(~{RTS})* 6(~{CTS})* 15(CBUS0)* 16(CBUS3)*

### Notes on the sheet
- USB/UART CONVERTER

### Library data of the parts
C1-C3 = CS - CAPACITOR: TOLERANCE: 10%; VOLTAGE: 16V; Supplier 1: *; (FIELD A): *; (FLIED C): *; (FIELD B): *; Manufacturer: *
  C1: Supplier Part Number 1: 587-3238-1-ND
  C2 C3: Supplier Part Number 1: 490-1532-1-ND
D3 D6 D21 = DS - TVS ESD5Z5.0T1G: TVS 5V; Manufacturer: ON Semiconductor; Supplier Part Number 1: ESD5Z5.0T1GOSCT-ND; Supplier 1: *; FORWARS VOLTAGE: *; (FIELD A): *; (FIELD B): *; Supplier 2: Digi-Key; Supplier Part Number 2: ESD5Z5.0T1GOSCT-ND
R5-R8 = RS - RESISTOR: TOLERANCE: RES TOL; POWER: RES POWER; Supplier 1: *; (FIELD A): *; (FLIED C): *; (FIELD B): *; Manufacturer: *
  R5 R6 R8: Supplier Part Number 1: *
  R7: Supplier Part Number 1: RHM27CGCT-ND
U1 = IC - FT230XS: USB to BASIC UART IC; Manufacturer: FTDI; Supplier 1: Digi-Key; Supplier Part Number 1: 768-1154-5-ND; (FIELD A): *; (FIELD B): *; (FIELD C): *
D4 D5 = LED - NORMAL LED: CURRENT: *; COLOR: *; FORWARS VOLTAGE: *; Supplier Part Number 1: *; Supplier 1: *; (FIELD B): *; (FIELD A): *; (FIELD C): *; Manufacturer: *

## Sheet Volant5.Back_Button_v1.0.SchDoc
size A4
Used 2 times, as channels BKSW1, BKSW2. Parts and nets are listed once, with the designators drawn on the sheet.
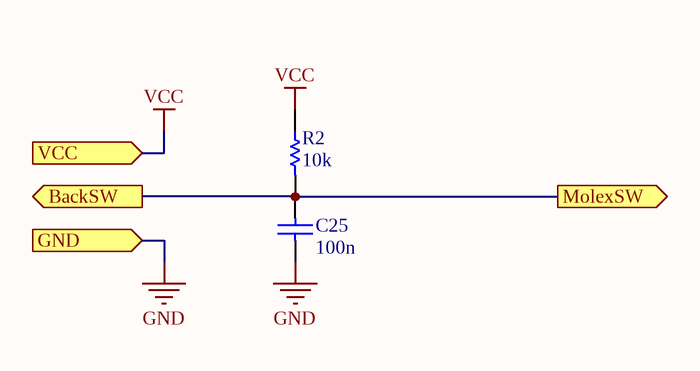
[diagram p8: Volant5.Back_Button_v1.0.SchDoc]

### Parts
C25  value 100n  [CS-0603]  (hidden comment: CS - CAPACITOR)
R2  value 10k  [RS-0603]  (hidden comment: RS - RESISTOR)

### Ports
BackSW (out), GND (in), MolexSW (out), VCC (in)

### Nets
GND: C25.1 ; port GND
VCC: R2.1 ; port VCC
BackSW: C25.2 R2.2 ; port BackSW, port MolexSW

### Channels
BKSW1: designators end in .1; ports BackSW=BACKSW1 GND=GND MolexSW=BACKSW1 VCC=3V3
BKSW2: designators end in .2; ports BackSW=BACKSW2 GND=GND MolexSW=BACKSW2 VCC=3V3

### Library data of the parts
C25 = CS - CAPACITOR: VOLTAGE: 16V; TOLERANCE: 10%; Supplier 1: *; Supplier Part Number 1: 490-1532-1-ND; (FIELD A): *; (FLIED C): *; (FIELD B): *; Manufacturer: *
R2 = RS - RESISTOR: POWER: RES POWER; TOLERANCE: RES TOL; Supplier Part Number 1: RHM10.0KCFCT-ND; Supplier 1: *; (FIELD A): *; (FLIED C): *; (FIELD B): *; Manufacturer: *

## Sheet Volant5.ROTARY_SW_v1.0.SchDoc
size A
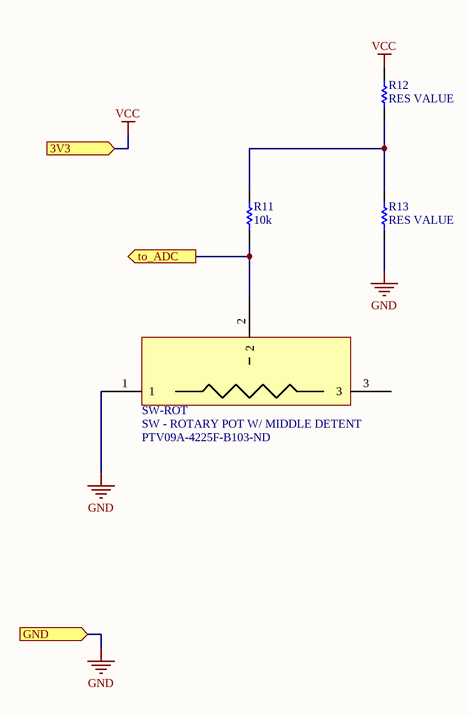
[diagram p9: Volant5.ROTARY_SW_v1.0.SchDoc]

### Parts
R11  value 10k  [RS-0603]  (hidden comment: RS - RESISTOR)
R12  value RES VALUE  [RS-0603]  (hidden comment: RS - RESISTOR)
R13  value RES VALUE  [RS-0603]  (hidden comment: RS - RESISTOR)
SW-ROT  SW - ROTARY POT W/ MIDDLE DETENT  Supplier Part Number 1: PTV09A-4225F-B103-ND  [SW - ROTARY POT W/ DETENT]

### Ports
3V3 (in), GND (in), to_ADC (out)

### Nets
GND: R13.1 SW-ROT.1 ; port GND
VCC: R12.2 ; port 3V3  [project net 3V3]
AP3: R11.1 SW-ROT.2 ; port to_ADC
NetR11_2: R11.2 R12.1 R13.2

Not connected (* = marked no-connect by the designer): SW-ROT 3

### Library data of the parts
R11-R13 = RS - RESISTOR: TOLERANCE: RES TOL; POWER: RES POWER; Supplier Part Number 1: *; Supplier 1: *; (FIELD A): *; (FLIED C): *; (FIELD B): *; Manufacturer: *
SW-ROT = SW - ROTARY POT W/ MIDDLE DETENT: Potentiomètre rotatif +-140 deg avec détente au milieu; KNOB: 226-4105-ND; Supplier 1: Digi-Key

## Nets that join several sheets
3V3: Volant5 (P5.2), Volant5.Power (C21.2 C22.2 R20.2 U6.3), Volant5.PIC32MX_circuit_1.0 (13 pins), Volant5.CAN_transceiver_1.0 (5 pins), SW3 (R24.1.1), SW4 (R24.2.1), SW5 (R24.3.1), SW6 (R24.4.1), SW7 (R24.5.1), SW8 (R24.6.1), SW9 (R24.7.1), SW10 (R24.8.1), SW11 (R24.9.1), SW12 (R24.10.1), LED1 (R1.1.2), LED2 (R1.2.2), LED3 (R1.3.2), LED4 (R1.4.2), LED5 (R1.5.2), LED6 (R1.6.2), LED7 (R1.7.2), LED8 (R1.8.2), Volant5.LEDdriver (C7.1 C8.2 U4.19 U4.21), USB-UART_1.0 (R5.2 R6.2), BKSW1 (R2.1.1), BKSW2 (R2.2.1), Volant5.ROTARY_SW_v1.0 (R12.2)
5V_USB: Volant5 (P6.4), USB-UART_1.0 (C1.2 C2.2 D3.K U1.12)
GND: Volant5 (5 pins), Volant5.Power (8 pins), Volant5.PIC32MX_circuit_1.0 (12 pins), Volant5.CAN_transceiver_1.0 (7 pins), SW3 (C24.1.1 S1.1.2), SW4 (C24.2.1 S1.2.2), SW5 (C24.3.1 S1.3.2), SW6 (C24.4.1 S1.4.2), SW7 (C24.5.1 S1.5.2), SW8 (C24.6.1 S1.6.2), SW9 (C24.7.1 S1.7.2), SW10 (C24.8.1 S1.8.2), SW11 (C24.9.1 S1.9.2), SW12 (C24.10.1 S1.10.2), Volant5.LEDdriver (6 pins), USB-UART_1.0 (8 pins), BKSW1 (C25.1.1), BKSW2 (C25.2.1), Volant5.ROTARY_SW_v1.0 (R13.1 SW-ROT.1)
VBAT: Volant5 (P1.4), Volant5.Power (5 pins)
AP3: Volant5.PIC32MX_circuit_1.0 (U5.14), Volant5.ROTARY_SW_v1.0 (R11.1 SW-ROT.2)
BACKSW1: Volant5 (P1.6), Volant5.PIC32MX_circuit_1.0 (U5.52), BKSW1 (C25.1.2 R2.1.2)
BACKSW2: Volant5 (P1.5), Volant5.PIC32MX_circuit_1.0 (U5.53), BKSW2 (C25.2.2 R2.2.2)
CAN_RX: Volant5.PIC32MX_circuit_1.0 (U5.58), Volant5.CAN_transceiver_1.0 (P3.2 U2.2)
CAN_TX: Volant5.PIC32MX_circuit_1.0 (U5.59), Volant5.CAN_transceiver_1.0 (P3.1 U2.3)
CANH: Volant5 (P1.7), Volant5.CAN_transceiver_1.0 (JP1.2 P2.2 U2.7)
CANL: Volant5 (P1.3), Volant5.CAN_transceiver_1.0 (P2.3 R4.2 U2.6)
CLK: Volant5.PIC32MX_circuit_1.0 (U5.49), Volant5.LEDdriver (P4.3 U4.5)
CS: Volant5.PIC32MX_circuit_1.0 (U5.46), Volant5.LEDdriver (P4.1 U4.3)
DIN: Volant5.PIC32MX_circuit_1.0 (U5.51), Volant5.LEDdriver (P4.4 U4.6)
DOUT: Volant5.PIC32MX_circuit_1.0 (U5.50), Volant5.LEDdriver (P4.2 U4.4)
LED1: Volant5.PIC32MX_circuit_1.0 (U5.21), LED1 (D1.1.K)
LED2: Volant5.PIC32MX_circuit_1.0 (U5.22), LED2 (D1.2.K)
LED3: Volant5.PIC32MX_circuit_1.0 (U5.23), LED3 (D1.3.K)
LED4: Volant5.PIC32MX_circuit_1.0 (U5.24), LED4 (D1.4.K)
LED5: Volant5.PIC32MX_circuit_1.0 (U5.27), LED5 (D1.5.K)
LED6: Volant5.PIC32MX_circuit_1.0 (U5.28), LED6 (D1.6.K)
LED7: Volant5.PIC32MX_circuit_1.0 (U5.29), LED7 (D1.7.K)
LED8: Volant5.PIC32MX_circuit_1.0 (U5.30), LED8 (D1.8.K)
MCLR: Volant5 (P5.1), Volant5.PIC32MX_circuit_1.0 (R14.2 R30.1)
Out3: Volant5.PIC32MX_circuit_1.0 (U5.54), SW3 (C24.1.2 R24.1.2 S1.1.1)
Out4: Volant5.PIC32MX_circuit_1.0 (U5.55), SW4 (C24.2.2 R24.2.2 S1.2.1)
Out5: Volant5.PIC32MX_circuit_1.0 (U5.42), SW5 (C24.3.2 R24.3.2 S1.3.1)
Out6: Volant5.PIC32MX_circuit_1.0 (U5.43), SW6 (C24.4.2 R24.4.2 S1.4.1)
Out7: Volant5.PIC32MX_circuit_1.0 (U5.44), SW7 (C24.5.2 R24.5.2 S1.5.1)
Out8: Volant5.PIC32MX_circuit_1.0 (U5.45), SW8 (C24.6.2 R24.6.2 S1.6.1)
Out9: Volant5.PIC32MX_circuit_1.0 (U5.60), SW9 (C24.7.2 R24.7.2 S1.7.1)
Out10: Volant5.PIC32MX_circuit_1.0 (U5.61), SW10 (C24.8.2 R24.8.2 S1.8.1)
Out11: Volant5.PIC32MX_circuit_1.0 (U5.62), SW11 (C24.9.2 R24.9.2 S1.9.1)
Out12: Volant5.PIC32MX_circuit_1.0 (U5.63), SW12 (C24.10.2 R24.10.2 S1.10.1)
PGEC: Volant5 (P5.5), Volant5.PIC32MX_circuit_1.0 (R17.1)
PGED: Volant5 (P5.4), Volant5.PIC32MX_circuit_1.0 (R18.1)
UART_RXD: Volant5.PIC32MX_circuit_1.0 (U5.4), USB-UART_1.0 (U1.4)
UART_TXD: Volant5.PIC32MX_circuit_1.0 (R3.2 U5.8), USB-UART_1.0 (U1.1)
USB_D+: Volant5 (P6.2), USB-UART_1.0 (R8.2)
USB_D-: Volant5 (P6.3), USB-UART_1.0 (R7.2)